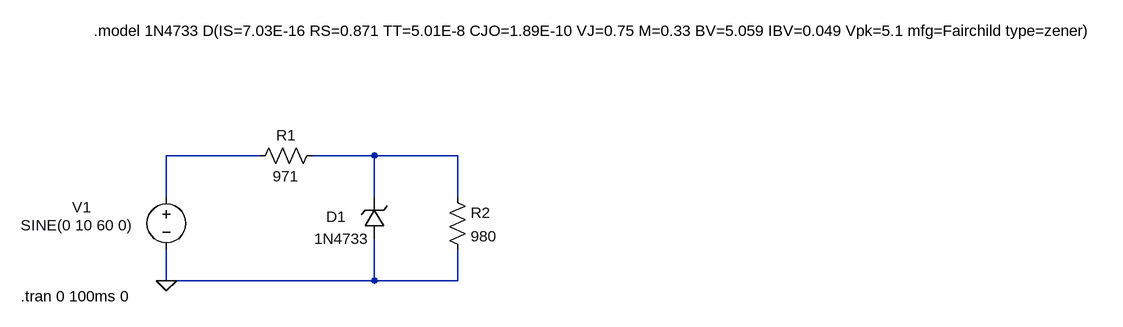
[diagram p0: schematic DiodoZener.asc]
DiodoZener.asc, the LTspice schematic file:
Version 4
SHEET 1 1540 680
WIRE 112 112 -32 112
WIRE 288 112 192 112
WIRE 416 112 288 112
WIRE -32 176 -32 112
WIRE 288 176 288 112
WIRE 416 176 416 112
WIRE -32 304 -32 256
WIRE 288 304 288 240
WIRE 288 304 -32 304
WIRE 416 304 416 256
WIRE 416 304 288 304
FLAG -32 304 0
SYMBOL res 208 96 R90
WINDOW 0 0 56 VBottom 2
WINDOW 3 32 56 VTop 2
SYMATTR InstName R1
SYMATTR Value 971
SYMBOL res 400 160 R0
SYMATTR InstName R2
SYMATTR Value 980
SYMBOL voltage -32 160 R0
WINDOW 0 -145 31 Left 2
WINDOW 3 -224 59 Left 2
WINDOW 123 0 0 Left 0
WINDOW 39 0 0 Left 0
SYMATTR InstName V1
SYMATTR Value SINE(0 10 60 0)
SYMBOL zener 304 240 R180
WINDOW 0 59 34 Left 2
WINDOW 3 24 0 Left 2
SYMATTR InstName D1
SYMATTR Value 1N4733
TEXT -144 -80 Left 2 !.model 1N4733 D(IS=7.03E-16 RS=0.871 TT=5.01E-8 CJO=1.89E-10 VJ=0.75 M=0.33 BV=5.059 IBV=0.049 Vpk=5.1 mfg=Fairchild type=zener)
TEXT -256 328 Left 2 !.tran 0 100ms 0

The netlist it stands for:
* DiodoZener.asc
R1 N002 N001 971
R2 N002 0 980
V1 N001 0 SINE(0 10 60 0)
D1 0 N002 1N4733
.model D D
.lib standard.dio
.model 1N4733 D(IS=7.03E-16 RS=0.871 TT=5.01E-8 CJO=1.89E-10 VJ=0.75 M=0.33 BV=5.059 IBV=0.049 Vpk=5.1 mfg=Fairchild type=zener)
.tran 0 100ms 0
.backanno
.end